# EAGLE schematic fio_proto_shield (EAGLE 5.02)
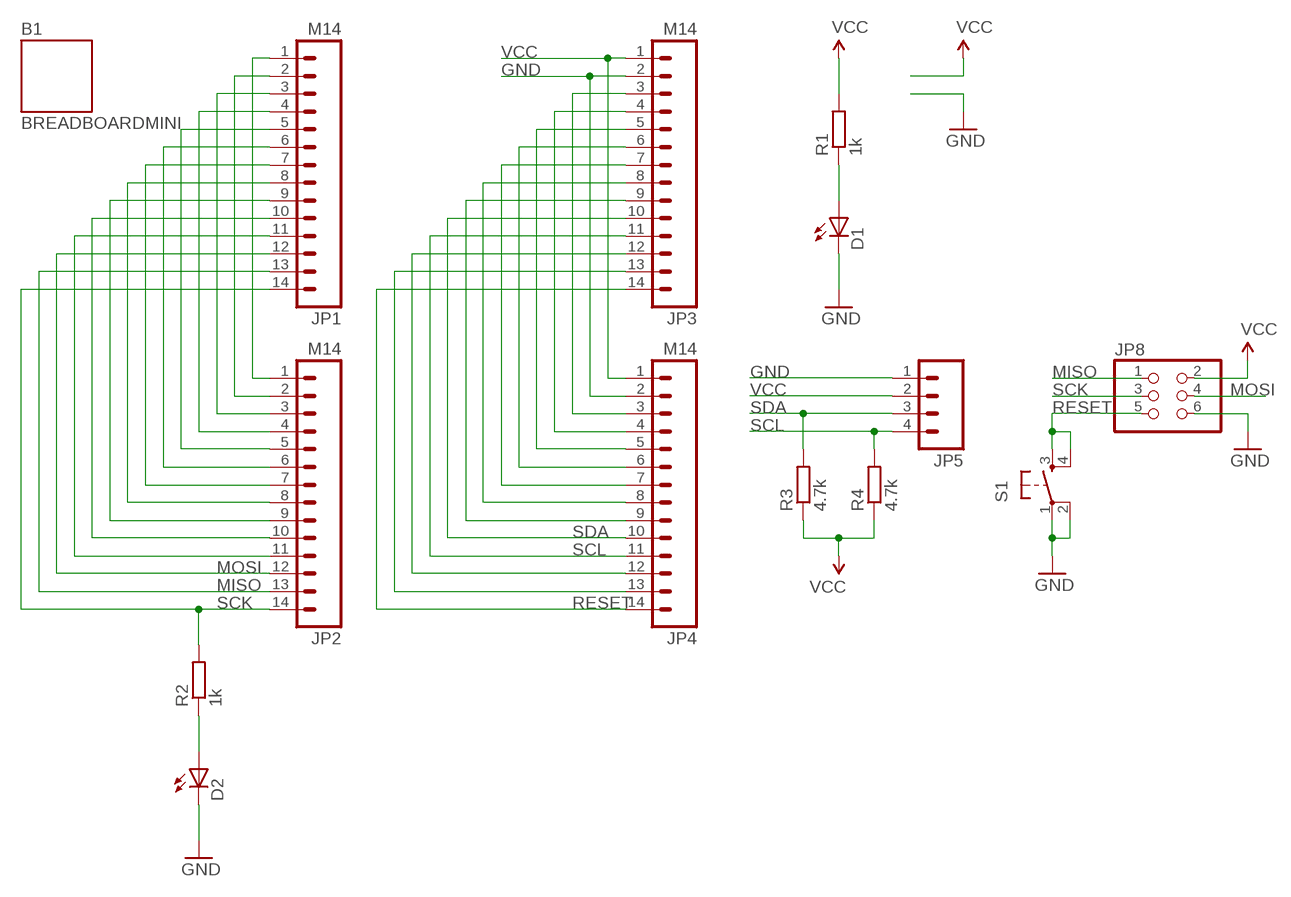
[diagram p0: schematic, sheet 1]

## Parts
B1  BREADBOARDMINI  [BREADBOARD-MINI]
D1  LED3MM  [LED3MM]
D2  LED3MM  [LED3MM]
JP1  M14  [1X14]
JP2  M14  [1X14]
JP3  M14  [1X14]
JP4  M14  [1X14]
JP5  M04PTH  [1X04]
JP8  PINHD-2X3  [2X03]
R1  1k  R-EU_0204/5  [0204/5]
R2  1k  R-EU_0204/5  [0204/5]
R3  4.7k  R-EU_0204/5  [0204/5]
R4  4.7k  R-EU_0204/5  [0204/5]
S1  TAC_SWITCHPTH  [TACTILE-PTH]

## Nets
GND: D1.K(C) D2.K(C) JP1.2 JP2.2 JP3.2 JP4.2 JP5.1 JP8.6 S1.1 S1.2
MISO: JP1.13 JP2.13 JP8.1
MOSI: JP1.12 JP2.12 JP8.4
N$3: JP1.3 JP2.3
N$4: JP1.4 JP2.4
N$5: JP1.5 JP2.5
N$6: JP1.6 JP2.6
N$7: JP1.7 JP2.7
N$8: JP1.8 JP2.8
N$9: JP1.9 JP2.9
N$10: JP1.10 JP2.10
N$11: JP1.11 JP2.11
N$12: D1.A R1.1
N$13: D2.A R2.1
N$17: JP3.3 JP4.3
N$18: JP3.4 JP4.4
N$19: JP3.5 JP4.5
N$20: JP3.6 JP4.6
N$21: JP3.7 JP4.7
N$22: JP3.8 JP4.8
N$23: JP3.9 JP4.9
N$26: JP3.12 JP4.12
N$27: JP3.13 JP4.13
RESET: JP3.14 JP4.14 JP8.5 S1.3 S1.4
SCK: JP1.14 JP2.14 JP8.3 R2.2
SCL: JP3.11 JP4.11 JP5.4 R4.2
SDA: JP3.10 JP4.10 JP5.3 R3.2
VCC: JP1.1 JP2.1 JP3.1 JP4.1 JP5.2 JP8.2 R1.2 R3.1 R4.1

## Library data of the parts
B1 = SparkFun:BREADBOARD: Breadboard Mini Self Adhesive This is the mechnical outline for the very small self adhesive breadboard from SparkFun Electronics. Good for very small proto areas. SKU : PRT-07916
D1 D2 = SparkFun:LED: LEDs Standard schematic elements and footprints for 5mm, 3mm, 1206, and 0603 sized LEDs. 5mm - Spark Fun Electronics SKU : COM-00529 (and others)
JP1-JP4 = SparkFun:M14: Header 14 Standard 14-pin 0.1" header. Use with straight break away headers (SKU : PRT-00116), right angle break away headers (PRT-00553), swiss pins (PRT-00743), machine pins (PRT-00117), and female headers (PRT-00115).
JP5 = SparkFun:M04: Header 4 Standard 4-pin 0.1" header. Use with straight break away headers (SKU : PRT-00116), right angle break away headers (PRT-00553), swiss pins (PRT-00743), machine pins (PRT-00117), and female headers (PRT-00115). Molex polarized connector foot print use with SKU : PRT-08231 with associated crimp pins and housings.
JP8 = pinhead:PINHD-2X3: PIN HEADER
R1-R4 = rcl:R-EU_: RESISTOR, European symbol
S1 = SparkFun:TAC_SWITCH: Momentary Switch Button commonly used for reset or general input. Spark Fun Electronics SKU : COM-00097